# Altium project CustomTP4056Module_SMD.PrjPcb
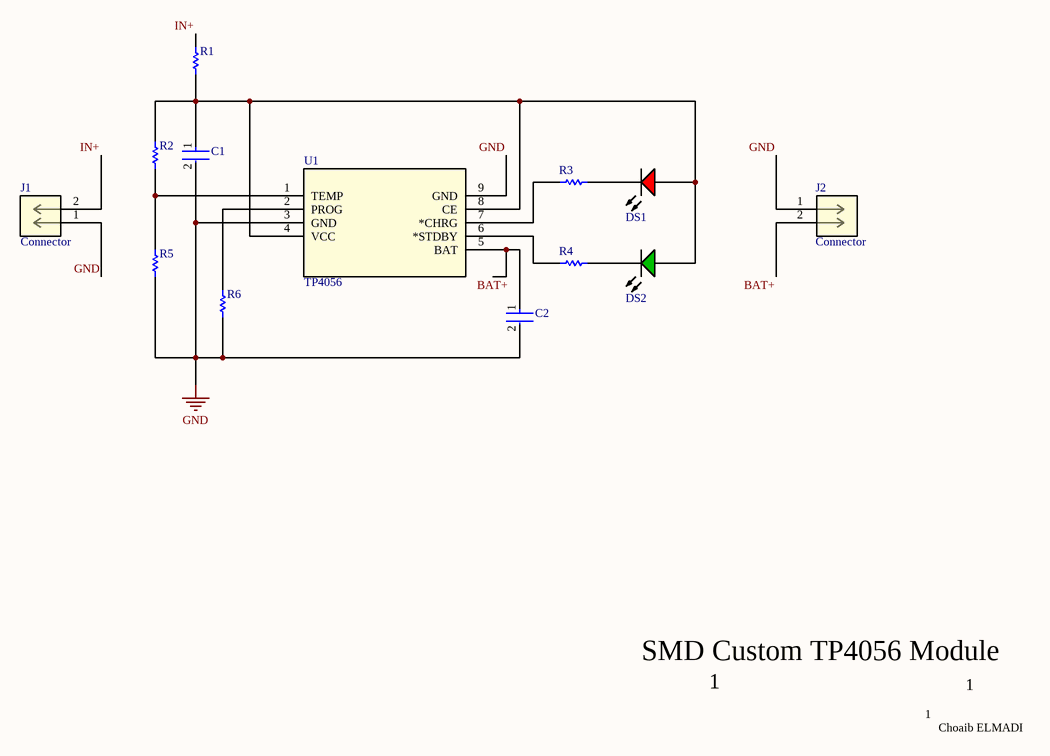
[diagram p0: CustomTP4056Module_SMD.SchDoc]
1 sheet, 13 parts. Net scope: global (net labels, ports and power ports of the same name join across sheets).
Board file: CustomTP4056Module_SMD.PcbDoc

## Sheet CustomTP4056Module_SMD.SchDoc
size A; SheetNumber: 1; SheetTotal: 1

### Parts
C1  1206ZC106KAT2A  [FP-1206-L_3_2_0_2-W_1_6_0-IPC_C]  (value not drawn)
C2  1206ZC106KAT2A  [FP-1206-L_3_2_0_2-W_1_6_0-IPC_C]  (value not drawn)
DS1  LTST-C170KRKT  [LTST-C170KRKT_V]  (value not drawn)
DS2  LTST-C170KGKT  [LTST-LTST-C170KGKT-2_V]  (value not drawn)
J1  Connector  [CONN_M20-99902_HRW]
J2  Connector  [CONN_M20-99902_HRW]
R1  ERA3AEB221V  [RESC1608X55X30LL20T20]  (value not drawn)
R2  ERA3AEB221V  [RESC1608X55X30LL20T20]  (value not drawn)
R3  ERA3AEB221V  [RESC1608X55X30LL20T20]  (value not drawn)
R4  ERA3AEB221V  [RESC1608X55X30LL20T20]  (value not drawn)
R5  ERA3AEB221V  [RESC1608X55X30LL20T20]  (value not drawn)
R6  ERA3AEB221V  [RESC1608X55X30LL20T20]  (value not drawn)
U1  TP4056  [ESOP8_TPW]

### Nets
GND: C1.2 C2.2 J1.1 J2.1 R5.1 R6.2 U1.3(GND) U1.9(GND)
BAT+: C2.1 J2.2 U1.5(BAT)
IN+: J1.2 R1.1
NetC1_1: C1.1 DS1.1(A) DS2.2(A) R1.2 R2.2 U1.4(VCC) U1.8(CE)
NetDS1_2: DS1.2(K) R3.2
NetDS2_1: DS2.1(K) R4.2
NetR2_1: R2.1 R5.2 U1.1(TEMP)
NetR3_1: R3.1 U1.7(*CHRG)
NetR4_1: R4.1 U1.6(*STDBY)
NetR6_1: R6.1 U1.2(PROG)

### Notes on the sheet
- SMD Custom TP4056 Module
- 1
- Choaib ELMADI

### Library data of the parts
C1 C2 = CMP-04427-011061-1: General Purpose Ceramic Capacitor, 1206, 10uF, 10%, X7R, 15%, 10V; Dissipation Factor: 5%; Packaging: Tape and Reel; REACH SVHC: No SVHC; Voltage Rating: 10V; Capacitance: 10uF; Number of Pins: 2; Mount: Surface Mount; Height: 1.78mm; Case/Package: 1206; Max Operating Temperature: 125°C; Construction: Flat; Package Quantity: 1; Case Code (Metric): 3216; Voltage Rating (DC): 10V; Series: -; RoHS Compliant: Yes; Contact Plating: Tin; Depth: 1.6mm; Voltage: 10V; Case Code (Imperial): 1206; Termination: SMD/SMT; Dielectric: X7R; Min Operating Temperature: -55°C; Thickness: 0.07inch; Length: 3.2mm; Lead Free: Lead Free; Width: 0.063inch; Tolerance: 10%; Radiation Hardening: No
DS1 = CMP-2000-07593-1: LED Red, 75 mW, 54 mcd, -55 to 85 degC, 2-Pin SMD, RoHS, Tape and Reel; Manufacturer: Lite-On; Lens Transparency: Clear; Number of Elements: 1; Power Rating: 75mW; Luminous Intensity: 54mcd; Viewing Angle: 130degrees; Forward Current: 30mA; Wavelength: 639nm; Lens Style: Rectangular; Case\/Package: 0805; Test Current: 20mA; Dominant Wavelength: 631nm; Forward Voltage: 2V; Lens Colour: Colorless; Min Operating Temperature: -55degC; RoHSCompliant: True; Length: 3.2mm; Width: 1.25mm; Mount: SurfaceMount; Packaging: TapeandReel; Number of LEDs: 1; Radiation Hardening: No; Datasheet URL: http://optoelectronics.liteon.com/upload/download/DS-22-99-0150/LTST-C170KRKT.pdf; Datasheet Version: Rev. D, 11/2014; Case Code (Metric): 2012; Height: 1.1mm; Number of Pins: 2; Package Description: 2-Pin Surface Mount Device, Body 2 x 1.25 mm; Manufacturer URL: http://www.us.liteon.com/; Lead Free: LeadFree; Illumination Colour: Red; Colour: Red; Case Code (Imperial): 0805; Max Operating Temperature: 85degC; Power Dissipation: 75mW; Mounting Technology: SurfaceMount; Package Reference: C170KRKT; Package Quantity: 1; Depth: 1.6mm
DS2 = CMP-2000-06620-1: Ultra Bright AlInGaP Chip LED, 75 mW, -55 to 85 degC, 2-Pin SMD (0805), RoHS, Tape and Reel; Manufacturer: Lite-On; Forward Current: 30mA; Power Dissipation Max: 75mW; Emitting Color: YellowGreen; Type: Uni-Color; Forward Voltage: 2.4V; Dominant Wave Length: 571nm; Test Current (It): 20mA; Product Length (mm): 2mm; Peak Wavelength: 574nm; Power Dissipation: 75W; Product Depth (mm): 1.25mm; DELETED: Compliant; High Brightness: Yes; Product Height (mm): 1.1mm; Luminous Intensity: 35mcd; Shape Type: Rectangular; Chip Material: AlGaInP; Viewing Angle: 130deg; Number of  Elements: 1; Reverse Voltage: 5V; Rad Hardened: No; Package Type: ChipLed; Manufacturer URL: http://www.us.liteon.com/; Mounting: SurfaceMount; Operating Temp Range: -55Cto85C; Datasheet URL: http://optoelectronics.liteon.com/upload/download/DS22-2000-073/S_110_LTST-C170KGKT.pdf; Packaging: TapeandReel; Pin Count: 2; Package Description: 2-Pin Surface Mounted Device, Body 2 x 1.25 mm; Mounting Technology: SurfaceMount; Package Reference: LTST-C170KGKT-2; Forward Current Max: 30mA; Datasheet Version: Rev. G, 06/2005; Lens Dimensions: 1.4x1.25x0.6mm; Operating Temperature Classification: Industrial; Lum Intensity: 35mcd; Main Category: ChipLED
J1 J2 = M20-9990245: No Description Available; Mfr_Name: Harwin; RefDes: RefDes; Type: Type
R1-R6 = CMP-2000-00954-1: Manufacturer: Panasonic; Part Number: ERA3AEB221V
U1 = TP4056: No Description Available; Mfr_Name: TOPPOWER; RefDes: RefDes; Type: Type